# EAGLE design revision_1.2 (EAGLE 9.3.0)
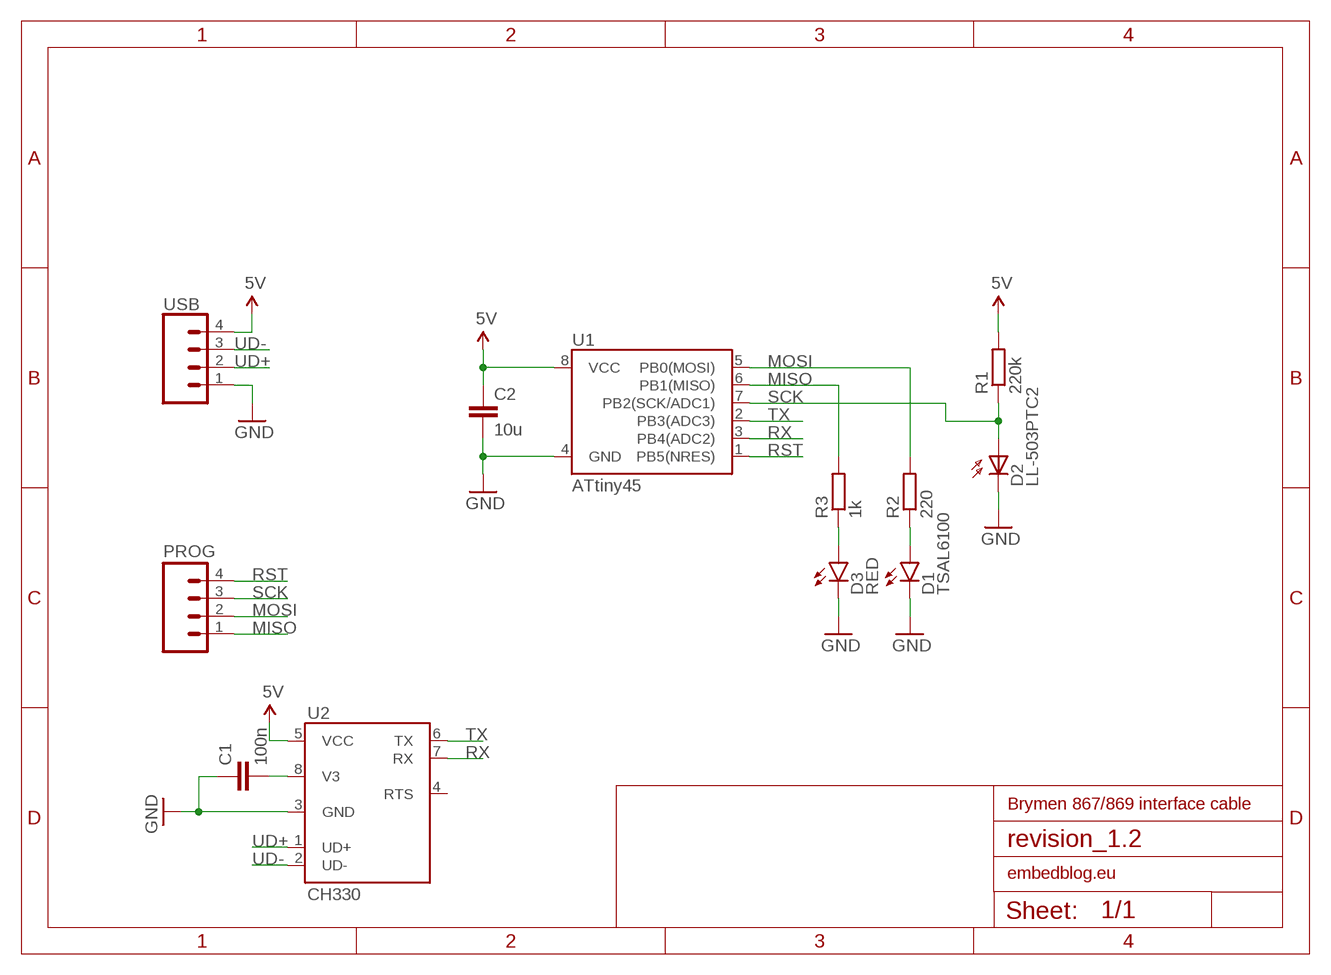
[diagram p0: schematic, sheet 1]

## Parts
C1  100n  C-EUC0805  [C0805]
C2  10u  C-EUC0805  [C0805]
D1  TSAL6100  LED5MM  [LED5MM]
D2  LL-503PTC2  BPX65  [BPX65]
D3  RED  LED1206  [LED-1206]
PROG  M04NO_SILK_ALL_ROUND  [1X04_NO_SILK_ALL_ROUND]
R1  220k  R-EU_R0805  [R0805]
R2  220  R-EU_R0805  [R0805]
R3  1k  R-EU_R0805  [R0805]
U1  ATtiny45  ATTINY45TINY85-20-SMT  [SO08-EIAJ]
U2  CH330  [SO08]
USB  CONN_04  [1X04]

## Nets
5V: C2.1 R1.2 U1.8(VCC) U2.5(VCC) USB.4
GND: C1.1 C2.2 D1.K(C) D2.K(C) D3.C U1.4(GND) U2.3(GND) USB.1
MISO: PROG.1 R3.2 U1.6(PB1(MISO))
MOSI: PROG.2 R2.2 U1.5(PB0(MOSI))
N$1: C1.2 U2.8(V3)
N$3: D1.A R2.1
N$5: D3.A R3.1
RST: PROG.4 U1.1(PB5(NRES))
RX: U1.3(PB4(ADC2)) U2.7(RX)
SCK: D2.A PROG.3 R1.1 U1.7(PB2(SCK/ADC1))
TX: U1.2(PB3(ADC3)) U2.6(TX)
UD+: U2.1(UD+) USB.2
UD-: U2.2(UD-) USB.3
Unconnected: U2.4(RTS)

## Notes on the sheet
- Brymen 867/869 interface cable
- embedblog.eu

## Library data of the parts
C1 C2 = resistor:C-EU: CAPACITOR, European symbol
D1 D3 = SparkFun-LED:LED: LEDs Standard schematic elements and footprints for 5mm, 3mm, 1206, and 0603 sized LEDs. 5mm - Spark Fun Electronics SKU : COM-00529 (and others)
D2 = opto-trans-siemens:BPX65: PHOTO DIODE; MPN: BPX65.; OC_FARNELL: 327451; OC_NEWARK: 06WX2764
PROG = SparkFun-Connectors:M04: Header 4 Standard 4-pin 0.1" header. Use with straight break away headers (SKU : PRT-00116), right angle break away headers (PRT-00553), swiss pins (PRT-00743), machine pins (PRT-00117), and female headers (PRT-00115). Molex polarized connector foot print use with SKU : PRT-08231 with associated crimp pins and housings. 1MM SMD Version SKU: PRT-10208; PROD_ID: CONN-09696
R1-R3 = resistor:R-EU_: RESISTOR, European symbol
U1 = SparkFun-DigitalIC:ATTINY45: Atmel 8-pin 2/4/8kB flash uC; PROD_ID: IC-09092; VALUE: Tiny85-20-SMT
U2 = custom:CH330
USB = SparkFun-Connectors:CONN_04: Multi connection point. Often used as Generic Header-pin footprint for 0.1 inch spaced/style header connections On any of the 0.1 inch spaced packages, you can populate with these: Break Away Headers - Straight <https://www.sparkfun.com/products/116> (PRT-00116) Break Away Male Headers - Right Angle <https://www.sparkfun.com/products/553> (PRT-00553) Female Headers <https://www.sparkfun.com/products/115> (PRT-00115) Break Away Headers - Machine Pin <https://www.sparkfun.com/products/117> (PRT-00117) Break Away Female Headers - Swiss Machine Pin <https://www.sparkfun.com/products/743> (PRT-00743) For SCREWTERMINALS and SPRING TERMINALS visit here: Screw Terimnals on SparkFun.com <https://www.sparkfun.com/search/results?term=Screw+Terminals> (5mm/3.5mm/2.54mm spacing) This device is also useful as a general connection point to wire up your design to another part of your project. Our various solder wires solder well into these plated through hole pads. Hook-Up Wire - Assortment (Stranded, 22 AWG) <https://www.sparkfun.com/products/11375> (PRT-11375) Hook-Up Wire - Assortment (Solid Core, 22 AWG) <https://www.sparkfun.com/products/11367> (PRT-11367) View the entire wire category on our website here <https://www.sparkfun.com/categories/141> Special notes: Molex polarized connector foot print use with SKU : PRT-08231 with associated crimp pins and housings. 1MM SMD Version SKU: PRT-10208; PROD_ID: CONN-09696

## Board
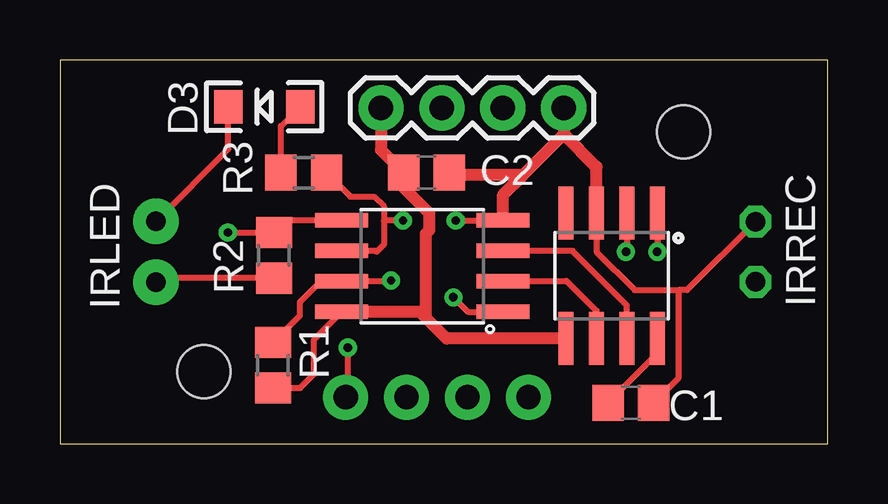
[diagram p1: board, top side]
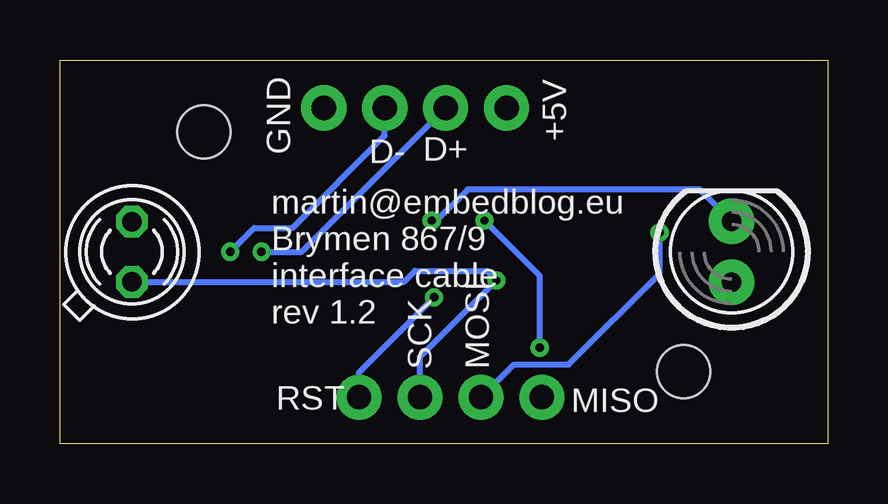
[diagram p2: board, bottom side, seen from below]

Size 32 x 16 mm. Coordinates in mm from the lower left corner, seen from the top.
Outline: 0,0 32,0 32,16 0,16 0,0
Copper layers (1*16): Top 0.035mm / dielectric 1.5mm / Bottom 0.035mm
Design rules "default": minimum track width 6mil, minimum drill 0.35mm, track to track 6mil, track to pad 6mil, pad to pad 6mil, via to via 6mil, smd to smd 6mil, copper to edge 40mil, drill to drill 6mil, minimum pad ring 10mil, minimum via ring 8mil, stop-mask expansion 4mil, vias tented up to drill 0mil, thermal gap 10mil
Holes 2.2 mm at 6,3 26,13

### Footprints (pad centres in the part's own frame; a part is rotated, then mirrored left to right if it is on the bottom)
C0805 = smd 1.3 x 1.5: 1 -0.95,0; 2 0.95,0
LED5MM = drill 0.813 pad 1.88: A -1.27,0; K 1.27,0
BPX65 = drill 0.813 octagon: A -0.889,-0.889; K 0.889,0.889
LED-1206 = smd 1.2 x 1.4: A -1.5,0; C 1.5,0
1X04_NO_SILK_ALL_ROUND = drill 1.016 pad 1.88: 1 0,0; 2 2.54,0; 3 5.08,0; 4 7.62,0
R0805 = smd 1.3 x 1.5: 1 -0.95,0; 2 0.95,0
SO08-EIAJ = smd 0.61 x 2.21: 1 -1.905,-3.378; 2 -0.635,-3.378; 3 0.635,-3.378; 4 1.905,-3.378; 5 1.905,3.353; 6 0.635,3.353; 7 -0.635,3.353; 8 -1.905,3.353
SO08 = smd 0.61 x 2.21: 1 -1.905,-2.616; 2 -0.635,-2.616; 3 0.635,-2.616; 4 1.905,-2.616; 5 1.905,2.616; 6 0.635,2.616; 7 -0.635,2.616; 8 -1.905,2.616
1X04 = drill 1.016 pad 1.88: 1 0,0; 2 2.54,0; 3 5.08,0; 4 7.62,0

### Placement (x,y rotation side)
C1  23.8,1.7 180 top
C2  15.28,11.3 0 top
D1  4,8 90 bottom
D2  29,8 45 bottom
D3  8.52,14.05 180 top
PROG  11.91,1.93 0 top
R1  8.88,3.27 270 top
R2  8.92,7.85 90 top
R3  10.16,11.3 0 top
U1  15.1,7.4 90 top
U2  23,7 180 top
USB  21,14 180 top

### Tracks (layer width: path | path; a pad name or v marks a point on that pad's centre or on a via)
5V
  Top 0.254: R1.2 10.02,2.32 10.6,2.9 10.6,4.35 U1.8
  Top 0.508: USB.4 13.38,12.25 C2.1 | 14.3,11.27 C2.1 | U2.5 16.12,4.38 15.25,5.25 | 15.25,5.25 15,5.5 U1.8 | 15.25,5.25 15.25,8.75 15.4,8.9 15.4,9.6 14.33,10.67 C2.1
GND  (via drill 0.35)
  Top 0.254: D2.K 26.14,6.4 25.8,6.4 | U2.3 22.36,8 23.96,6.4 25.8,6.4 | C1.1 25.8,2.75 25.8,6.4 | D1.K 7.02,12.29 D3.C | v16.5,9.3 U1.4
  Top 0.508: USB.1 21,12.9 | 21,12.9 19.3,11.2 | 19.3,11.2 16.33,11.2 C2.2 | U1.4 18.48,10.38 19.3,11.2 | U2.3 22.36,11.54 21,12.9
  Bottom 0.254: D1.K 5.33,10.6 15,10.6 16.3,9.3 v16.5,9.3
MISO  (via drill 0.35)
  Top 0.254: R3.2 12.11,10.3 13.1,10.3 13.5,9.9 13.5,9.3 | 13.5,9.3 13.5,8.3 13.2,8 13.16,8.04 U1.6 | PROG.1 12,2.11 v12,4 | v14.3,9.3 13.5,9.3
  Bottom 0.254: v12,4 12,7 v14.3,9.3
MOSI  (via drill 0.35)
  Top 0.254: U1.5 9.43,9.3 R2.2 v7,8.8
  Bottom 0.254: v7,8.8 7,7.1 10.8,3.3 13.08,3.3 PROG.2
N$1
  Top 0.254: C1.2 24.91,3.75 U2.8
N$3
  Top 0.254: R2.1 4.17,6.9 D1.A
N$5
  Top 0.254: R3.1 9.21,13.24 D3.A
RST  (via drill 0.35)
  Top 0.254: v16.4,6.1 17,5.5 U1.1
  Bottom 0.254: PROG.4 19.53,2.97 v16.4,6.1
RX
  Top 0.254: U2.7 23.64,5.76 21.36,8.04 U1.3
SCK  (via drill 0.35)
  Top 0.254: R1.1 10,5.34 10,5.9 10.7,6.6 10.8,6.6 10.96,6.76 U1.7 13.77,6.76 v13.8,6.8
  Bottom 0.254: D2.A 17.66,6.74 17.2,7.2 14.2,7.2 v13.8,6.8 16.99,3.61 PROG.3
TX
  Top 0.254: U2.6 22.36,5.54 21.1,6.8 21.07,6.76 U1.2
UD+  (via drill 0.35)
  Top 0.254: U2.1 v24.91,8.01 v24.9,8
  Bottom 0.254: v24.9,8 23.9,9 22.3,9 18.46,12.84 USB.2
UD-  (via drill 0.35)
  Top 0.254: U2.2 23.64,8.04 v23.6,8
  Bottom 0.254: USB.3 21.92,8 v23.6,8

### Text on the board
tNames: IRLED | IRREC
bNames: +5V | GND | D+ | D- | martin@embedblog.eu / Brymen 867/9 / interface cable / rev 1.2 | MOSI | SCK | MISO | RST